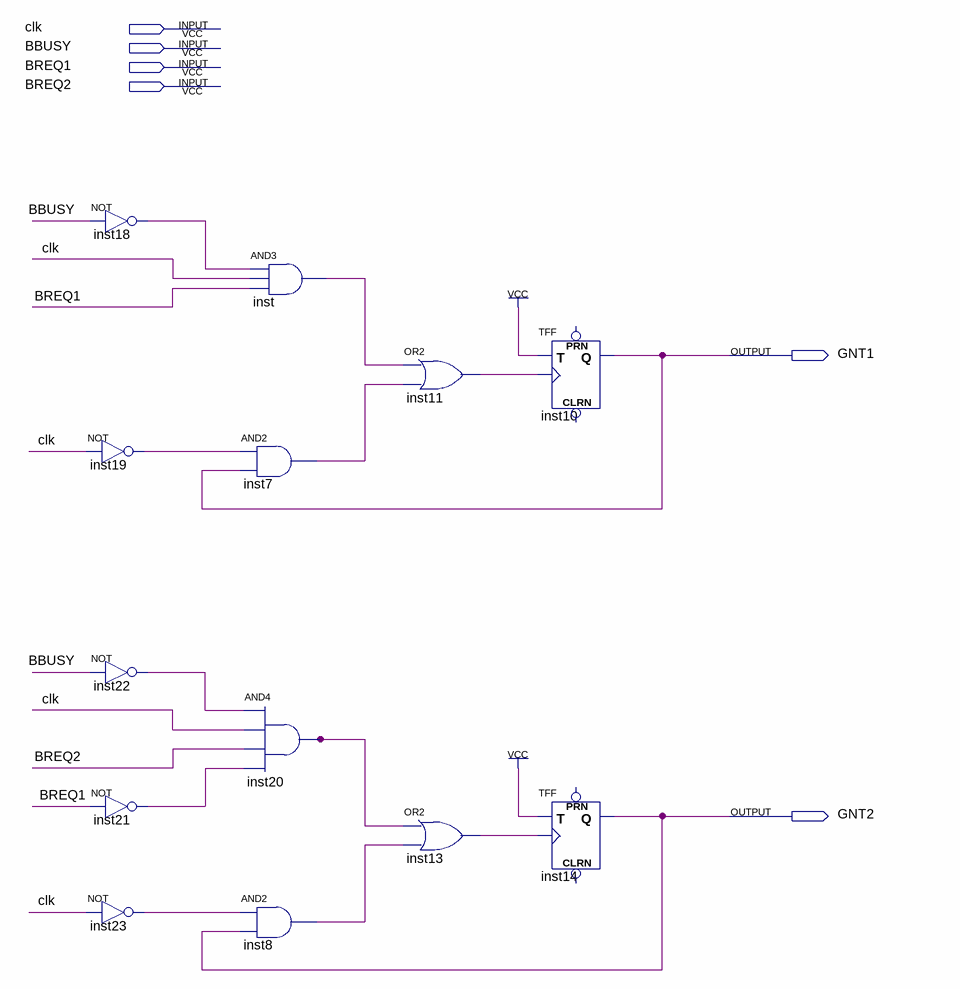
[diagram p0: schematic sheet]
// Quartus schematic arbiter.bdf as structural Verilog: 13 symbols, 6 pins
module arbiter (
  input  clk,
  input  BBUSY,
  input  BREQ1,
  input  BREQ2,
  output GNT1,
  output GNT2
);

  wire inst7_out, inst8_out, inst11_out, inst13_out, inst18_out, inst19_out, inst20_out, inst21_out,
       inst22_out, inst23_out, inst_out;

  not inst18 (inst18_out, BBUSY);
  not inst19 (inst19_out, clk);
  not inst22 (inst22_out, BBUSY);
  not inst21 (inst21_out, BREQ1);
  not inst23 (inst23_out, clk);
  and inst (inst_out, inst18_out, clk, BREQ1);
  and inst7 (inst7_out, inst19_out, GNT1);
  and inst20 (inst20_out, inst22_out, clk, BREQ2, inst21_out);
  and inst8 (inst8_out, inst23_out, GNT2);
  or inst11 (inst11_out, inst_out, inst7_out);
  or inst13 (inst13_out, inst20_out, inst8_out);
  TFF inst10 (.T(1'b1), .CLK(inst11_out), .Q(GNT1));  // open: PRN, CLRN
  TFF inst14 (.T(1'b1), .CLK(inst13_out), .Q(GNT2));  // open: PRN, CLRN
endmodule
